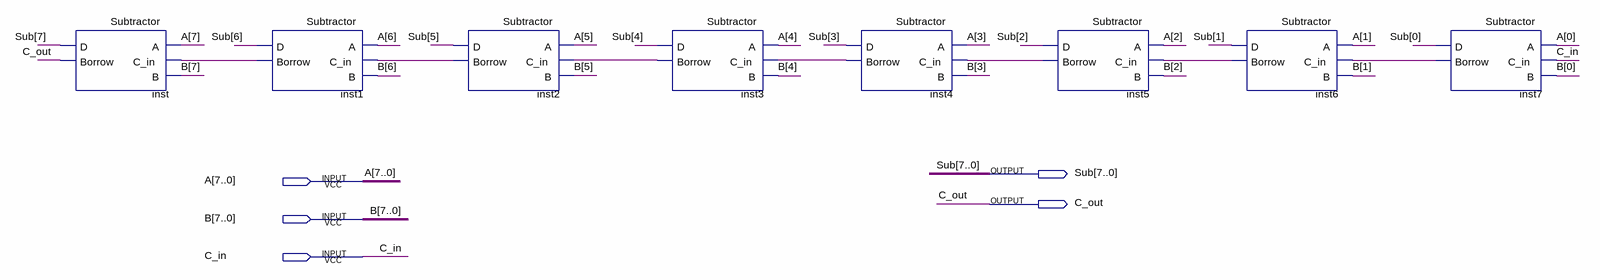
[diagram p0: schematic sheet]
// Quartus schematic Subtractor_8bit.bdf as structural Verilog: 8 symbols, 5 pins
module Subtractor_8bit (
  input  [7:0] A,
  input  [7:0] B,
  input  C_in,
  output [7:0] Sub,
  output C_out
);

  wire inst1_borrow, inst2_borrow, inst3_borrow, inst4_borrow, inst5_borrow, inst6_borrow, inst7_borrow;

  Subtractor inst (.A(A[7]), .C_in(inst1_borrow), .B(B[7]), .D(Sub[7]), .Borrow(C_out));
  Subtractor inst1 (.A(A[6]), .C_in(inst2_borrow), .B(B[6]), .D(Sub[6]), .Borrow(inst1_borrow));
  Subtractor inst2 (.A(A[5]), .C_in(inst3_borrow), .B(B[5]), .D(Sub[5]), .Borrow(inst2_borrow));
  Subtractor inst3 (.A(A[4]), .C_in(inst4_borrow), .B(B[4]), .D(Sub[4]), .Borrow(inst3_borrow));
  Subtractor inst4 (.A(A[3]), .C_in(inst5_borrow), .B(B[3]), .D(Sub[3]), .Borrow(inst4_borrow));
  Subtractor inst5 (.A(A[2]), .C_in(inst6_borrow), .B(B[2]), .D(Sub[2]), .Borrow(inst5_borrow));
  Subtractor inst6 (.A(A[1]), .C_in(inst7_borrow), .B(B[1]), .D(Sub[1]), .Borrow(inst6_borrow));
  Subtractor inst7 (.A(A[0]), .C_in(C_in), .B(B[0]), .D(Sub[0]), .Borrow(inst7_borrow));
endmodule
